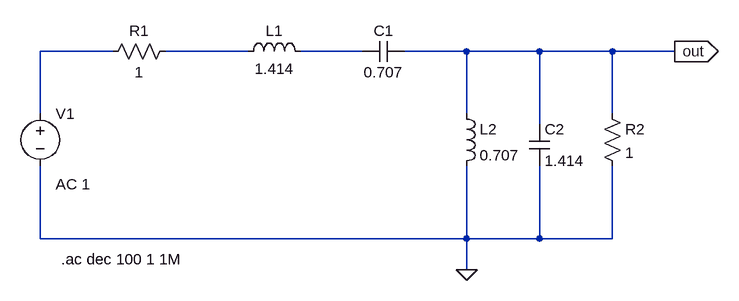
[diagram p0: schematic Part3.asc]
Part3.asc, the LTspice schematic file:
Version 4.1
SHEET 1 1136 680
WIRE 176 64 64 64
WIRE 384 64 256 64
WIRE 560 64 464 64
WIRE 720 64 624 64
WIRE 832 64 720 64
WIRE 944 64 832 64
WIRE 1040 64 944 64
WIRE 64 160 64 64
WIRE 720 160 720 64
WIRE 944 160 944 64
WIRE 832 176 832 64
WIRE 64 352 64 240
WIRE 720 352 720 240
WIRE 720 352 64 352
WIRE 832 352 832 240
WIRE 832 352 720 352
WIRE 944 352 944 240
WIRE 944 352 832 352
WIRE 720 400 720 352
FLAG 1040 64 out
IOPIN 1040 64 Out
FLAG 720 400 0
SYMBOL voltage 64 144 R0
WINDOW 123 24 124 Left 2
WINDOW 39 0 0 Left 0
SYMATTR InstName V1
SYMATTR Value ""
SYMATTR Value2 AC 1
SYMBOL res 272 48 R90
WINDOW 0 0 56 VBottom 2
WINDOW 3 32 56 VTop 2
SYMATTR InstName R1
SYMATTR Value 1
SYMBOL ind 368 80 R270
WINDOW 0 32 56 VTop 2
WINDOW 3 5 56 VBottom 2
SYMATTR InstName L1
SYMATTR Value 1.414
SYMBOL cap 624 48 R90
WINDOW 0 0 32 VBottom 2
WINDOW 3 32 32 VTop 2
SYMATTR InstName C1
SYMATTR Value 0.707
SYMBOL ind 704 144 R0
SYMATTR InstName L2
SYMATTR Value 0.707
SYMBOL cap 816 176 R0
SYMATTR InstName C2
SYMATTR Value 1.414
SYMBOL res 928 144 R0
SYMATTR InstName R2
SYMATTR Value 1
TEXT 96 384 Left 2 !.ac dec 100 1 1M

The netlist it stands for:
* Part3.asc
V1 N001 0 AC 1
R1 N002 N001 1
L1 N002 N003 1.414
C1 out N003 0.707
L2 out 0 0.707
C2 out 0 1.414
R2 out 0 1
.ac dec 100 1 1M
.backanno
.end